# Altium schematic sheet Glue.SchDoc: Glue Logic
size A; Author: Matt Harlum; DrawnBy: Matt Harlum; SheetNumber: 1; SheetTotal: 1
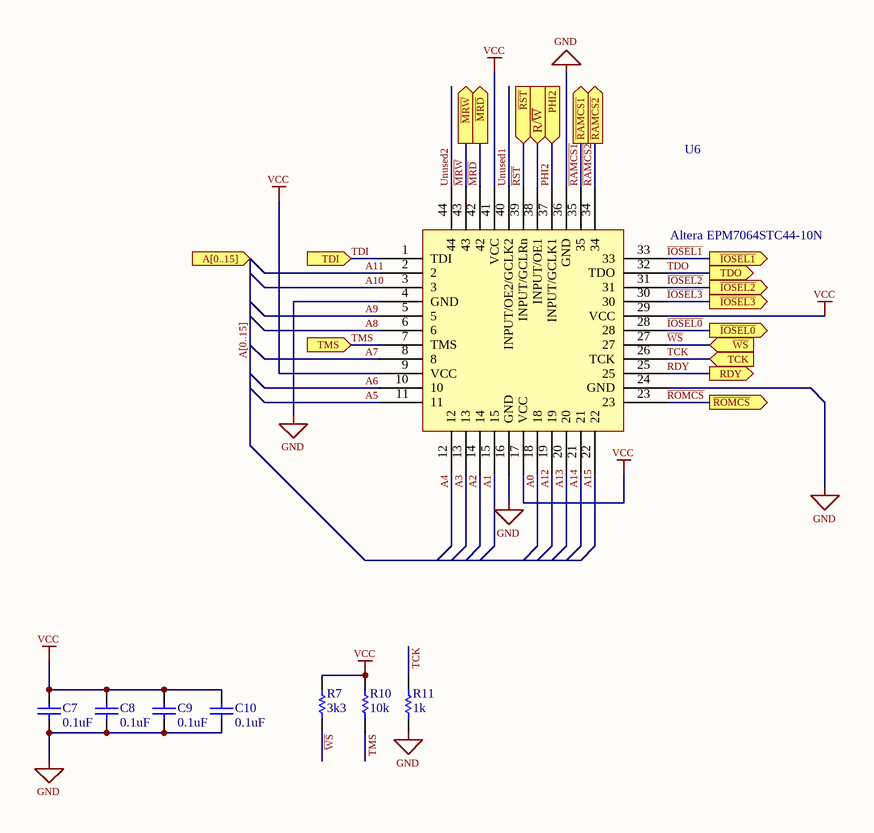
[diagram p0: Glue.SchDoc]

## Parts
C7  0.1uF  [CAPC1608X90X35NL15T15]
C8  0.1uF  [CAPC1608X90X35NL15T15]
C9  0.1uF  [CAPC1608X90X35NL15T15]
C10  0.1uF  [CAPC1608X90X35NL15T15]
R7  3k3  [RESC1608X55X30ML20T10]
R10  10k  [RESC1609X50X30NL10T20]
R11  1k  [RESC1608X55X30NL15T15]
U6  Altera EPM7064STC44-10N  [PCB-3kl8984h228uy08r94zq-1]

## Ports
A[0..15] (in), PHI2 (in), R/~{W} (in), RDY (out), TCK (in), TDI (in), TDO (out), TMS (in), ~{IOSEL0} (out), ~{IOSEL1} (out), ~{IOSEL2} (out), ~{IOSEL3} (out), ~{MRD} (out), ~{MRW} (out), ~{RAMCS1} (out), ~{RAMCS2} (out), ~{ROMCS} (out), ~{RST} (in), ~{WS} (in)

## Nets
GND: C7.2 C8.2 C9.2 C10.2 R11.1 U6.4(GND) U6.16(GND) U6.24(GND) U6.36(GND)
VCC: C7.1 C8.1 C9.1 C10.1 R7.1 R10.2 U6.9(VCC) U6.17(VCC) U6.29(VCC) U6.41(VCC)
A0: U6.18
A1: U6.15
A2: U6.14
A3: U6.13
A4: U6.12
A5: U6.11
A6: U6.10
A7: U6.8
A8: U6.6
A9: U6.5
A10: U6.3
A11: U6.2
A12: U6.19
A13: U6.20
A14: U6.21
A15: U6.22
~{IOSEL0}: U6.28 ; port ~{IOSEL0}
~{IOSEL1}: U6.33 ; port ~{IOSEL1}
~{IOSEL2}: U6.31 ; port ~{IOSEL2}
~{IOSEL3}: U6.30 ; port ~{IOSEL3}
~{MRD}: U6.42 ; port ~{MRD}
~{MRW}: U6.43 ; port ~{MRW}
PHI2: U6.37(INPUT/GCLK1) ; port PHI2
R/~{W}: U6.38(INPUT/OE1) ; port R/~{W}
~{RAMCS1}: U6.35 ; port ~{RAMCS1}
~{RAMCS2}: U6.34 ; port ~{RAMCS2}
~{ROMCS}: U6.23 ; port ~{ROMCS}
~{RST}: U6.39(INPUT/GCLRn) ; port ~{RST}
RDY: U6.25 ; port RDY
TCK: R11.2 U6.26(TCK) ; port TCK
TDI: U6.1(TDI) ; port TDI
TDO: U6.32(TDO) ; port TDO
TMS: R10.1 U6.7(TMS) ; port TMS
Unused1: U6.40(INPUT/OE2/GCLK2)
Unused2: U6.44
~{WS}: R7.2 U6.27 ; port ~{WS}

## Buses and harness runs
bus A[0..15] = port A[0..15]

## Notes on the sheet
- Title
- Size:
- Date:
- A
- Number:
- Time:
- Revision:
- Sheet
- of
- File:

## Library data of the parts
C7-C10 = 0603YC104KAT2A: 0603 0.1uF Capacitor; Insulation Resistance: 1e+11 Ω; Voltage Rating (DC): 16.0 V; Lead-Free Status: Lead Free; Dielectric Material: Ceramic Multilayer; Dielectric Characteristic: X7R; Capacitance Tolerance: ±10%; Capacitance: 1e-07 F; OctopartID: 0cd5c6920958d312; Number of Pins: 2; Size-Length: 0.0016002 m; Octopart Url: https://octopart.com/0603yc104kat2a-avx+interconnect+%2F+elco-55386347; Size-Height: 0.00086 m; Case/Package: 0603; REACH SVHC Compliance: No SVHC; RoHS: Compliant; Mounting Style: Surface Mount; Size-Width: 0.0008128 m
R7 = CMP-3658446-2: Thick Film Resistors - SMD 1/10watt 3.3Kohms 1%; Lead-Free Status: Lead Free; Power Rating: 0.1 W; Resistance: 3300.0 Ω; Case/Package: 0603; Mounting Style: Surface Mount; Octopart Url: https://octopart.com/rk73h1jttd3301f-koa+speer-5071100; OctopartID: 55949cd3100e8a53; Resistance Tolerance: ±1%; RoHS: Compliant
R10 = CMP-2823404-2: Res Thick Film 0603 10K Ohm 1% 0.1W(1/10W) ±100ppm/C Molded SMD Automotive Paper T/R; Lead-Free Status: Lead Free; Resistance: 10000.0 Ω; Voltage Rating (DC): 75.0 V; Case/Package: 0603; Number of Pins: 2; Octopart Url: https://octopart.com/crcw060310k0fkeb-vishay-42465018; OctopartID: a8d6635b7b4a7711; Packaging: Cut Tape (CT); Power Rating: 0.1 W; Resistance Tolerance: ±1%; RoHS: Compliant
R11 = CMP-a70b6f50b25278cc-3: RESISTOR, ANTI SULFUR, 1K, 0603, 5%; Resistance: 1kohm; Resistance Tolerance: ± 5%; Power Rating: 100mW; Voltage Rati...; Manufacturer Part Number: MCMR06X102 JTL; Resistance: 1.00 kΩ; OctopartID: a70b6f50b25278cc; Case/Package: 0603, 1608; Mounting Style: Surface Mount; RoHS: Compliant; REACH SVHC Compliance: No SVHC; Power Rating: 100 mW; Resistance Tolerance: ±5%; Packaging: Cut Tape (CT)
U6 = CMP-4ec387cff6eb9104-2: IC: CPLD; SMD; TQFP44; Series: Max 7000; Amount of macr; Number of Gates: 1250; Frequency: 125 MHz; REACH SVHC Compliance: No SVHC; Mounting Style: Surface Mount; Number of Pins: 44; Case/Package: TQFP